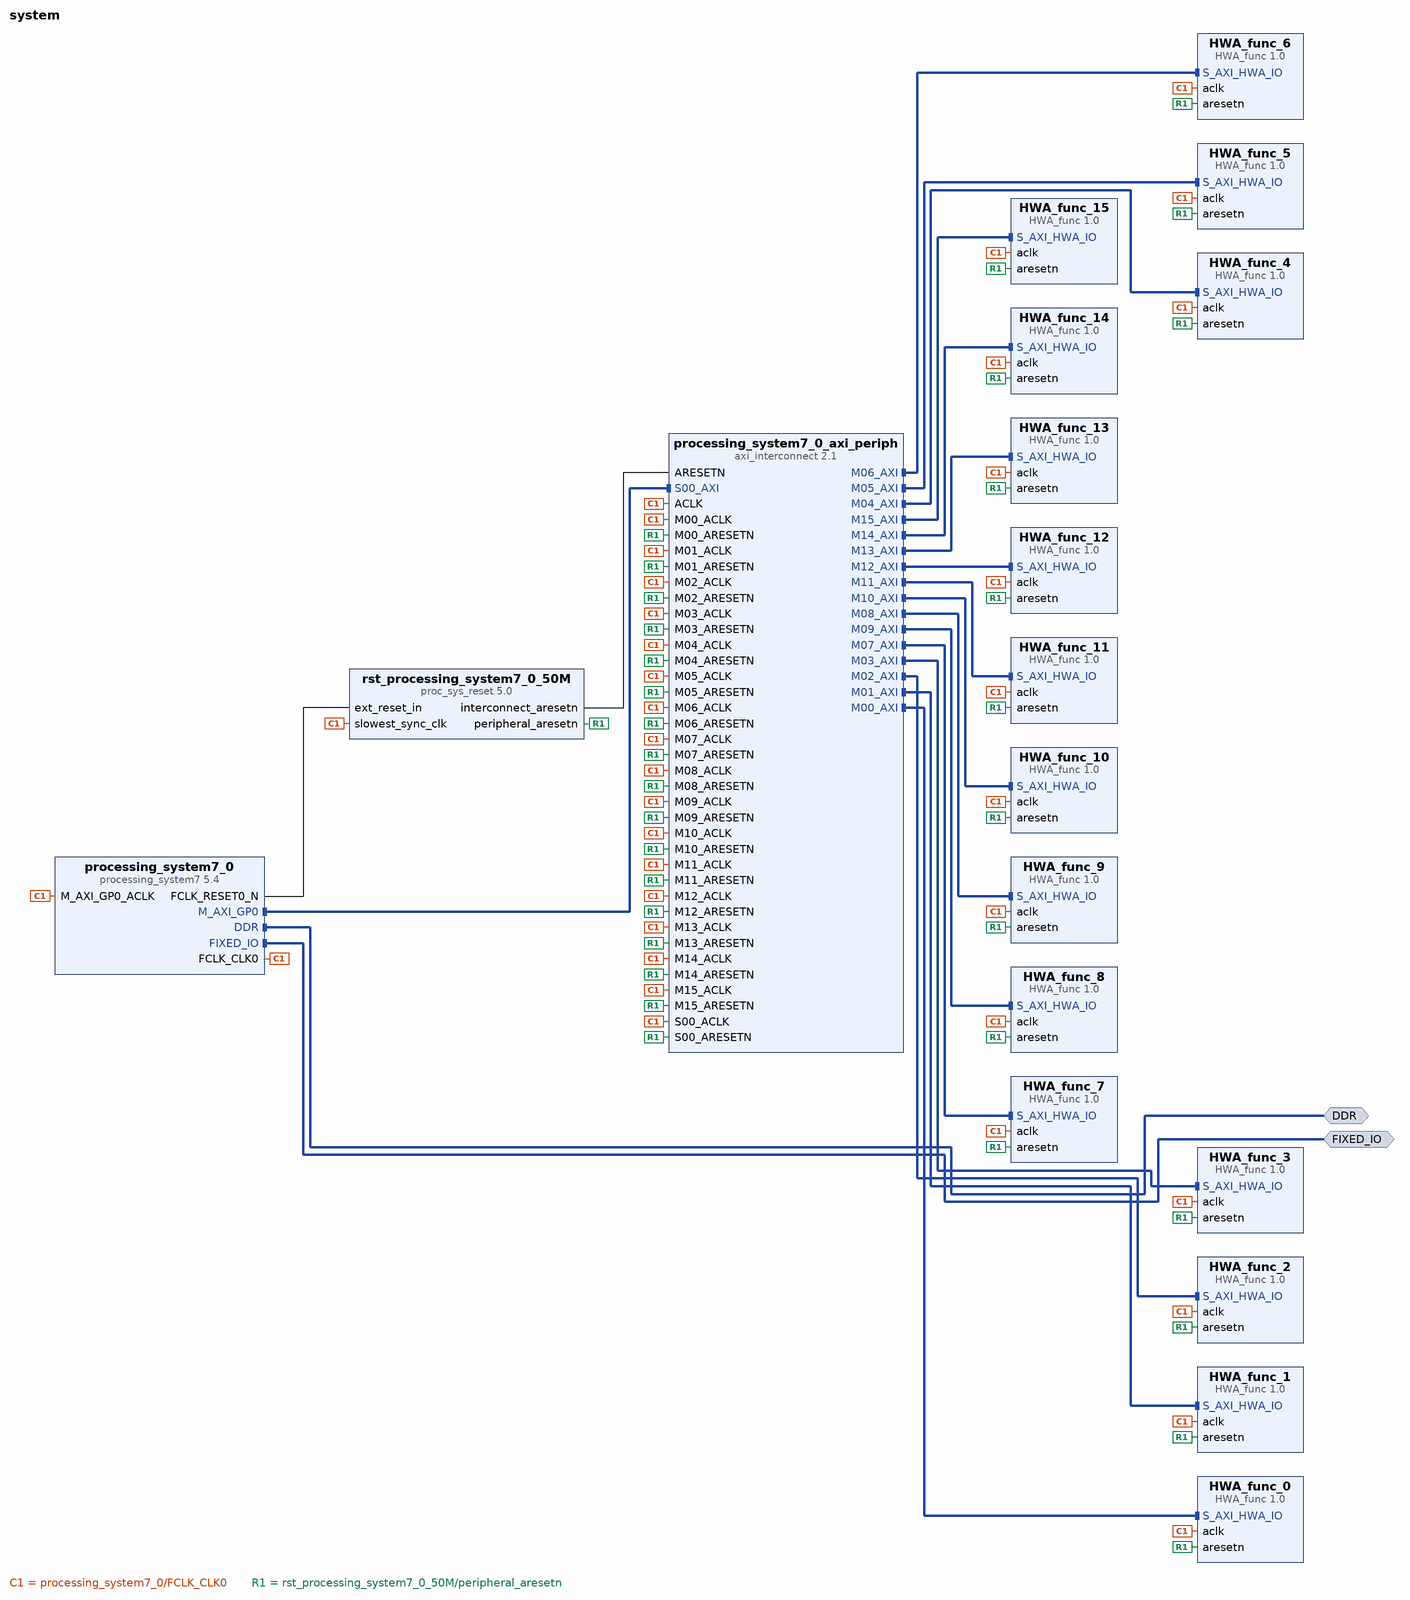
[diagram p0: block diagram of the top level]
# Vivado block design system, Vivado 2014.2
create_bd_design system

create_bd_intf_port -mode Master -vlnv xilinx.com:interface:ddrx_rtl:1.0 DDR
create_bd_intf_port -mode Master -vlnv xilinx.com:display_processing_system7:fixedio_rtl:1.0 FIXED_IO

create_bd_cell -type ip -vlnv xilinx.com:ip:processing_system7:5.4 processing_system7_0
set_property -dict {CONFIG.preset {ZC702*}} [get_bd_cells processing_system7_0]
create_bd_cell -type ip -vlnv xilinx.com:hls:HWA_func:1.0 HWA_func_0
create_bd_cell -type ip -vlnv xilinx.com:hls:HWA_func:1.0 HWA_func_1
create_bd_cell -type ip -vlnv xilinx.com:hls:HWA_func:1.0 HWA_func_2
create_bd_cell -type ip -vlnv xilinx.com:hls:HWA_func:1.0 HWA_func_3
create_bd_cell -type ip -vlnv xilinx.com:hls:HWA_func:1.0 HWA_func_4
create_bd_cell -type ip -vlnv xilinx.com:hls:HWA_func:1.0 HWA_func_5
create_bd_cell -type ip -vlnv xilinx.com:hls:HWA_func:1.0 HWA_func_6
create_bd_cell -type ip -vlnv xilinx.com:hls:HWA_func:1.0 HWA_func_7
create_bd_cell -type ip -vlnv xilinx.com:hls:HWA_func:1.0 HWA_func_8
create_bd_cell -type ip -vlnv xilinx.com:hls:HWA_func:1.0 HWA_func_9
create_bd_cell -type ip -vlnv xilinx.com:hls:HWA_func:1.0 HWA_func_10
create_bd_cell -type ip -vlnv xilinx.com:hls:HWA_func:1.0 HWA_func_11
create_bd_cell -type ip -vlnv xilinx.com:hls:HWA_func:1.0 HWA_func_12
create_bd_cell -type ip -vlnv xilinx.com:hls:HWA_func:1.0 HWA_func_13
create_bd_cell -type ip -vlnv xilinx.com:hls:HWA_func:1.0 HWA_func_14
create_bd_cell -type ip -vlnv xilinx.com:hls:HWA_func:1.0 HWA_func_15
create_bd_cell -type ip -vlnv xilinx.com:ip:axi_interconnect:2.1 processing_system7_0_axi_periph
set_property -dict {CONFIG.NUM_MI 16} [get_bd_cells processing_system7_0_axi_periph]
create_bd_cell -type ip -vlnv xilinx.com:ip:proc_sys_reset:5.0 rst_processing_system7_0_50M

# ---- connections ----

connect_bd_intf_net [get_bd_intf_pins processing_system7_0/M_AXI_GP0] [get_bd_intf_pins processing_system7_0_axi_periph/S00_AXI]
connect_bd_intf_net [get_bd_intf_pins processing_system7_0_axi_periph/M00_AXI] [get_bd_intf_pins HWA_func_0/S_AXI_HWA_IO]
connect_bd_intf_net [get_bd_intf_pins processing_system7_0_axi_periph/M01_AXI] [get_bd_intf_pins HWA_func_1/S_AXI_HWA_IO]
connect_bd_intf_net [get_bd_intf_pins processing_system7_0_axi_periph/M02_AXI] [get_bd_intf_pins HWA_func_2/S_AXI_HWA_IO]
connect_bd_intf_net [get_bd_intf_pins processing_system7_0_axi_periph/M03_AXI] [get_bd_intf_pins HWA_func_3/S_AXI_HWA_IO]
connect_bd_intf_net [get_bd_intf_pins processing_system7_0_axi_periph/M04_AXI] [get_bd_intf_pins HWA_func_4/S_AXI_HWA_IO]
connect_bd_intf_net [get_bd_intf_pins processing_system7_0_axi_periph/M05_AXI] [get_bd_intf_pins HWA_func_5/S_AXI_HWA_IO]
connect_bd_intf_net [get_bd_intf_pins processing_system7_0_axi_periph/M06_AXI] [get_bd_intf_pins HWA_func_6/S_AXI_HWA_IO]
connect_bd_intf_net [get_bd_intf_pins processing_system7_0_axi_periph/M07_AXI] [get_bd_intf_pins HWA_func_7/S_AXI_HWA_IO]
connect_bd_intf_net [get_bd_intf_pins processing_system7_0_axi_periph/M08_AXI] [get_bd_intf_pins HWA_func_9/S_AXI_HWA_IO]
connect_bd_intf_net [get_bd_intf_pins processing_system7_0_axi_periph/M09_AXI] [get_bd_intf_pins HWA_func_8/S_AXI_HWA_IO]
connect_bd_intf_net [get_bd_intf_pins processing_system7_0_axi_periph/M10_AXI] [get_bd_intf_pins HWA_func_10/S_AXI_HWA_IO]
connect_bd_intf_net [get_bd_intf_pins processing_system7_0_axi_periph/M11_AXI] [get_bd_intf_pins HWA_func_11/S_AXI_HWA_IO]
connect_bd_intf_net [get_bd_intf_pins processing_system7_0_axi_periph/M12_AXI] [get_bd_intf_pins HWA_func_12/S_AXI_HWA_IO]
connect_bd_intf_net [get_bd_intf_pins processing_system7_0_axi_periph/M13_AXI] [get_bd_intf_pins HWA_func_13/S_AXI_HWA_IO]
connect_bd_intf_net [get_bd_intf_pins processing_system7_0_axi_periph/M14_AXI] [get_bd_intf_pins HWA_func_14/S_AXI_HWA_IO]
connect_bd_intf_net [get_bd_intf_pins processing_system7_0_axi_periph/M15_AXI] [get_bd_intf_pins HWA_func_15/S_AXI_HWA_IO]
connect_bd_intf_net [get_bd_intf_ports DDR] [get_bd_intf_pins processing_system7_0/DDR]
connect_bd_intf_net [get_bd_intf_ports FIXED_IO] [get_bd_intf_pins processing_system7_0/FIXED_IO]
connect_bd_net [get_bd_pins processing_system7_0/FCLK_CLK0] \
  [get_bd_pins processing_system7_0/M_AXI_GP0_ACLK] [get_bd_pins processing_system7_0_axi_periph/S00_ACLK] \
  [get_bd_pins rst_processing_system7_0_50M/slowest_sync_clk] [get_bd_pins processing_system7_0_axi_periph/ACLK] \
  [get_bd_pins HWA_func_0/aclk] [get_bd_pins processing_system7_0_axi_periph/M00_ACLK] [get_bd_pins HWA_func_1/aclk] \
  [get_bd_pins processing_system7_0_axi_periph/M01_ACLK] [get_bd_pins HWA_func_2/aclk] \
  [get_bd_pins processing_system7_0_axi_periph/M02_ACLK] [get_bd_pins HWA_func_3/aclk] \
  [get_bd_pins processing_system7_0_axi_periph/M03_ACLK] [get_bd_pins HWA_func_4/aclk] \
  [get_bd_pins processing_system7_0_axi_periph/M04_ACLK] [get_bd_pins HWA_func_5/aclk] \
  [get_bd_pins processing_system7_0_axi_periph/M05_ACLK] [get_bd_pins HWA_func_6/aclk] \
  [get_bd_pins processing_system7_0_axi_periph/M06_ACLK] [get_bd_pins HWA_func_7/aclk] \
  [get_bd_pins processing_system7_0_axi_periph/M07_ACLK] [get_bd_pins HWA_func_9/aclk] \
  [get_bd_pins processing_system7_0_axi_periph/M08_ACLK] [get_bd_pins HWA_func_8/aclk] \
  [get_bd_pins processing_system7_0_axi_periph/M09_ACLK] [get_bd_pins HWA_func_10/aclk] \
  [get_bd_pins processing_system7_0_axi_periph/M10_ACLK] [get_bd_pins HWA_func_11/aclk] \
  [get_bd_pins processing_system7_0_axi_periph/M11_ACLK] [get_bd_pins HWA_func_12/aclk] \
  [get_bd_pins processing_system7_0_axi_periph/M12_ACLK] [get_bd_pins HWA_func_13/aclk] \
  [get_bd_pins processing_system7_0_axi_periph/M13_ACLK] [get_bd_pins HWA_func_14/aclk] \
  [get_bd_pins processing_system7_0_axi_periph/M14_ACLK] [get_bd_pins HWA_func_15/aclk] \
  [get_bd_pins processing_system7_0_axi_periph/M15_ACLK]
connect_bd_net [get_bd_pins processing_system7_0/FCLK_RESET0_N] [get_bd_pins rst_processing_system7_0_50M/ext_reset_in]
connect_bd_net [get_bd_pins rst_processing_system7_0_50M/peripheral_aresetn] \
  [get_bd_pins processing_system7_0_axi_periph/S00_ARESETN] [get_bd_pins HWA_func_0/aresetn] \
  [get_bd_pins processing_system7_0_axi_periph/M00_ARESETN] [get_bd_pins HWA_func_1/aresetn] \
  [get_bd_pins processing_system7_0_axi_periph/M01_ARESETN] [get_bd_pins HWA_func_2/aresetn] \
  [get_bd_pins processing_system7_0_axi_periph/M02_ARESETN] [get_bd_pins HWA_func_3/aresetn] \
  [get_bd_pins processing_system7_0_axi_periph/M03_ARESETN] [get_bd_pins HWA_func_4/aresetn] \
  [get_bd_pins processing_system7_0_axi_periph/M04_ARESETN] [get_bd_pins HWA_func_5/aresetn] \
  [get_bd_pins processing_system7_0_axi_periph/M05_ARESETN] [get_bd_pins HWA_func_6/aresetn] \
  [get_bd_pins processing_system7_0_axi_periph/M06_ARESETN] [get_bd_pins HWA_func_7/aresetn] \
  [get_bd_pins processing_system7_0_axi_periph/M07_ARESETN] [get_bd_pins HWA_func_9/aresetn] \
  [get_bd_pins processing_system7_0_axi_periph/M08_ARESETN] [get_bd_pins HWA_func_8/aresetn] \
  [get_bd_pins processing_system7_0_axi_periph/M09_ARESETN] [get_bd_pins HWA_func_10/aresetn] \
  [get_bd_pins processing_system7_0_axi_periph/M10_ARESETN] [get_bd_pins HWA_func_11/aresetn] \
  [get_bd_pins processing_system7_0_axi_periph/M11_ARESETN] [get_bd_pins HWA_func_12/aresetn] \
  [get_bd_pins processing_system7_0_axi_periph/M12_ARESETN] [get_bd_pins HWA_func_13/aresetn] \
  [get_bd_pins processing_system7_0_axi_periph/M13_ARESETN] [get_bd_pins HWA_func_14/aresetn] \
  [get_bd_pins processing_system7_0_axi_periph/M14_ARESETN] [get_bd_pins HWA_func_15/aresetn] \
  [get_bd_pins processing_system7_0_axi_periph/M15_ARESETN]
connect_bd_net [get_bd_pins rst_processing_system7_0_50M/interconnect_aresetn] [get_bd_pins processing_system7_0_axi_periph/ARESETN]

# ---- address map ----
assign_bd_address -offset 0x43C00000 -range 64K -target_address_space [get_bd_addr_spaces processing_system7_0/Data] [get_bd_addr_segs HWA_func_0/S_AXI_HWA_IO/Reg]
assign_bd_address -offset 0x43C10000 -range 64K -target_address_space [get_bd_addr_spaces processing_system7_0/Data] [get_bd_addr_segs HWA_func_1/S_AXI_HWA_IO/Reg]
assign_bd_address -offset 0x43C20000 -range 64K -target_address_space [get_bd_addr_spaces processing_system7_0/Data] [get_bd_addr_segs HWA_func_2/S_AXI_HWA_IO/Reg]
assign_bd_address -offset 0x43C30000 -range 64K -target_address_space [get_bd_addr_spaces processing_system7_0/Data] [get_bd_addr_segs HWA_func_3/S_AXI_HWA_IO/Reg]
assign_bd_address -offset 0x43C40000 -range 64K -target_address_space [get_bd_addr_spaces processing_system7_0/Data] [get_bd_addr_segs HWA_func_4/S_AXI_HWA_IO/Reg]
assign_bd_address -offset 0x43C50000 -range 64K -target_address_space [get_bd_addr_spaces processing_system7_0/Data] [get_bd_addr_segs HWA_func_5/S_AXI_HWA_IO/Reg]
assign_bd_address -offset 0x43C60000 -range 64K -target_address_space [get_bd_addr_spaces processing_system7_0/Data] [get_bd_addr_segs HWA_func_6/S_AXI_HWA_IO/Reg]
assign_bd_address -offset 0x43C70000 -range 64K -target_address_space [get_bd_addr_spaces processing_system7_0/Data] [get_bd_addr_segs HWA_func_7/S_AXI_HWA_IO/Reg]
assign_bd_address -offset 0x43C80000 -range 64K -target_address_space [get_bd_addr_spaces processing_system7_0/Data] [get_bd_addr_segs HWA_func_8/S_AXI_HWA_IO/Reg]
assign_bd_address -offset 0x43C90000 -range 64K -target_address_space [get_bd_addr_spaces processing_system7_0/Data] [get_bd_addr_segs HWA_func_9/S_AXI_HWA_IO/Reg]
assign_bd_address -offset 0x43CA0000 -range 64K -target_address_space [get_bd_addr_spaces processing_system7_0/Data] [get_bd_addr_segs HWA_func_10/S_AXI_HWA_IO/Reg]
assign_bd_address -offset 0x43CB0000 -range 64K -target_address_space [get_bd_addr_spaces processing_system7_0/Data] [get_bd_addr_segs HWA_func_11/S_AXI_HWA_IO/Reg]
assign_bd_address -offset 0x43CC0000 -range 64K -target_address_space [get_bd_addr_spaces processing_system7_0/Data] [get_bd_addr_segs HWA_func_12/S_AXI_HWA_IO/Reg]
assign_bd_address -offset 0x43CD0000 -range 64K -target_address_space [get_bd_addr_spaces processing_system7_0/Data] [get_bd_addr_segs HWA_func_13/S_AXI_HWA_IO/Reg]
assign_bd_address -offset 0x43CE0000 -range 64K -target_address_space [get_bd_addr_spaces processing_system7_0/Data] [get_bd_addr_segs HWA_func_14/S_AXI_HWA_IO/Reg]
assign_bd_address -offset 0x43CF0000 -range 64K -target_address_space [get_bd_addr_spaces processing_system7_0/Data] [get_bd_addr_segs HWA_func_15/S_AXI_HWA_IO/Reg]

validate_bd_design
save_bd_design
